# Altium schematic sheet Sheet1.SchDoc
size A4; Author: Samiru Nuwanaka; DrawnBy: Samiru Nuwanaka; Engineer: Samiru Nuwanaka; SheetNumber: 1; SheetTotal: 3
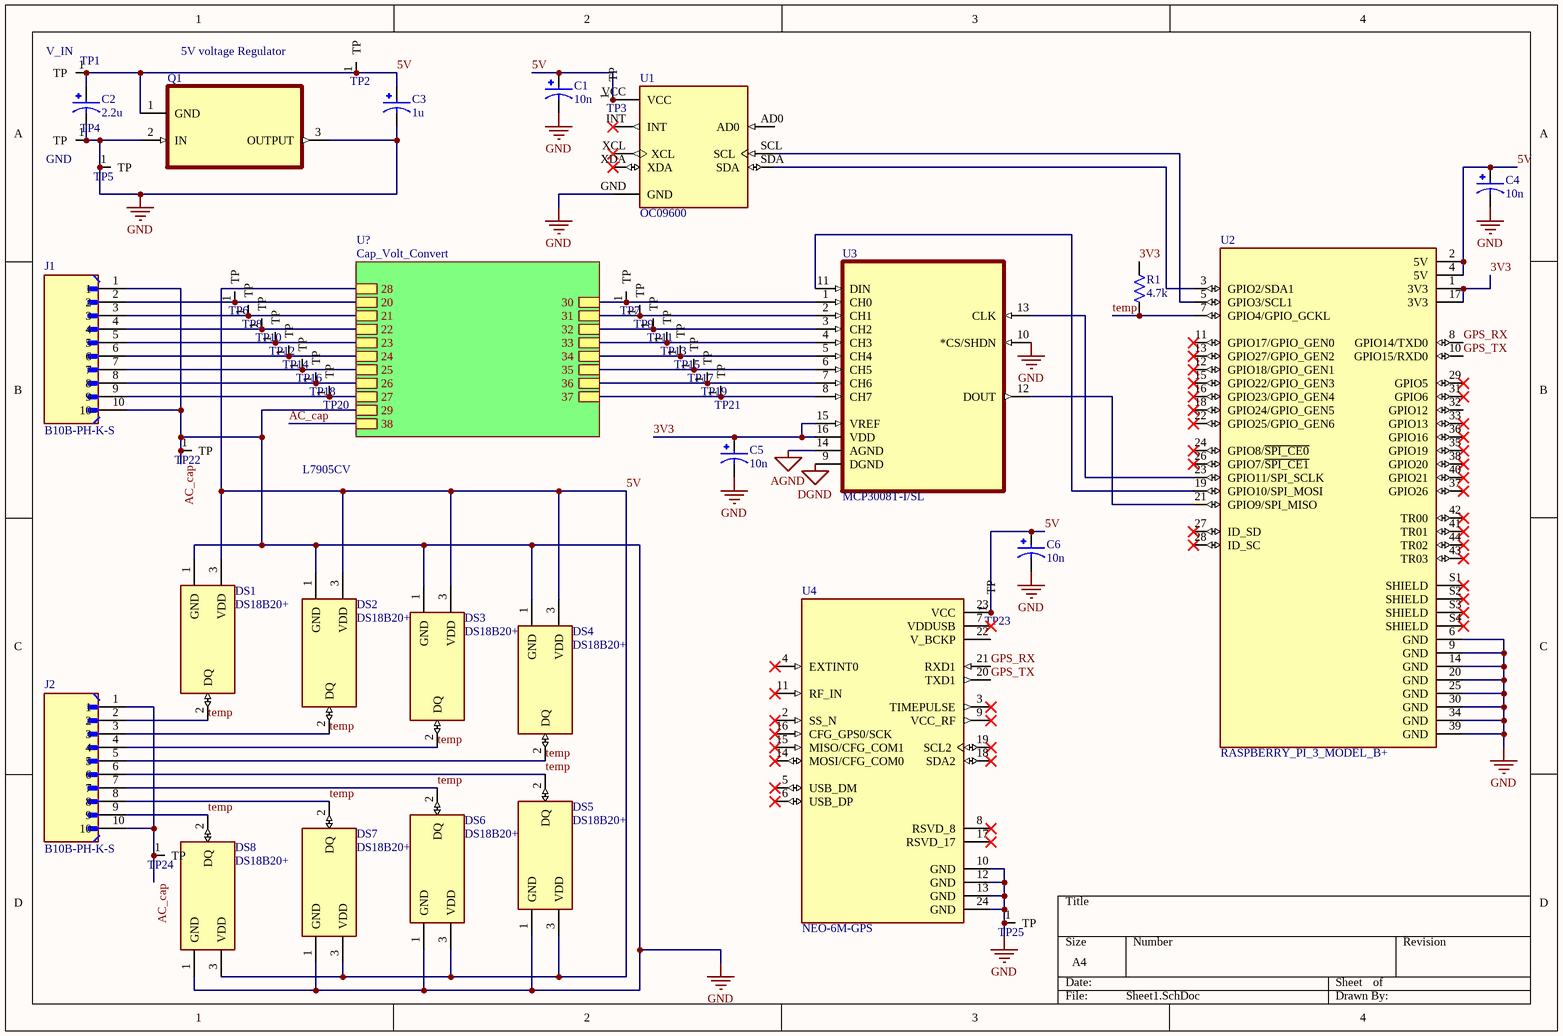
[diagram p0: Sheet1.SchDoc]

## Parts
C1  10n  [CAPPRD750W80D1600H2000]
C2  2.2u  [CAPPRD750W80D1600H2000]
C3  1u  [CAPPRD750W80D1600H2000]
C4  10n  [CAPPRD750W80D1600H2000]
C5  10n  [CAPPRD750W80D1600H2000]
C6  10n  [CAPPRD750W80D1600H2000]
DS1  DS18B20+  [IC_DS18B20+]
DS2  DS18B20+  [IC_DS18B20+]
DS3  DS18B20+  [IC_DS18B20+]
DS4  DS18B20+  [IC_DS18B20+]
DS5  DS18B20+  [IC_DS18B20+]
DS6  DS18B20+  [IC_DS18B20+]
DS7  DS18B20+  [IC_DS18B20+]
DS8  DS18B20+  [IC_DS18B20+]
J1  B10B-PH-K-S  [JST_B10B-PH-K-S]
J2  B10B-PH-K-S  [JST_B10B-PH-K-S]
Q1  L7905CV  [TO254P450X1020X1935-3P]
R1  4.7k  [RESAD730W45L370D210]
TP1  V_IN  [Testpoint]  (net tie, no BOM)
TP2  Testpoint  [Testpoint SMD]  (value not drawn)  (net tie, no BOM)
TP3  Testpoint  [Testpoint SMD]  (value not drawn)  (net tie, no BOM)
TP4  GND  [Testpoint]  (net tie, no BOM)
TP5  Testpoint  [Testpoint SMD]  (value not drawn)  (net tie, no BOM)
TP6  Testpoint  [Testpoint SMD]  (value not drawn)  (net tie, no BOM)
TP7  Testpoint  [Testpoint SMD]  (value not drawn)  (net tie, no BOM)
TP8  Testpoint  [Testpoint SMD]  (value not drawn)  (net tie, no BOM)
TP9  Testpoint  [Testpoint SMD]  (value not drawn)  (net tie, no BOM)
TP10  Testpoint  [Testpoint SMD]  (value not drawn)  (net tie, no BOM)
TP11  Testpoint  [Testpoint SMD]  (value not drawn)  (net tie, no BOM)
TP12  Testpoint  [Testpoint SMD]  (value not drawn)  (net tie, no BOM)
TP13  Testpoint  [Testpoint SMD]  (value not drawn)  (net tie, no BOM)
TP14  Testpoint  [Testpoint SMD]  (value not drawn)  (net tie, no BOM)
TP15  Testpoint  [Testpoint SMD]  (value not drawn)  (net tie, no BOM)
TP16  Testpoint  [Testpoint SMD]  (value not drawn)  (net tie, no BOM)
TP17  Testpoint  [Testpoint SMD]  (value not drawn)  (net tie, no BOM)
TP18  Testpoint  [Testpoint SMD]  (value not drawn)  (net tie, no BOM)
TP19  Testpoint  [Testpoint SMD]  (value not drawn)  (net tie, no BOM)
TP20  Testpoint  [Testpoint SMD]  (value not drawn)  (net tie, no BOM)
TP21  Testpoint  [Testpoint SMD]  (value not drawn)  (net tie, no BOM)
TP22  Testpoint  [Testpoint]  (value not drawn)  (net tie, no BOM)
TP23  Testpoint  [Testpoint SMD]  (value not drawn)  (net tie, no BOM)
TP24  Testpoint  [Testpoint SMD]  (value not drawn)  (net tie, no BOM)
TP25  Testpoint  [Testpoint SMD]  (value not drawn)  (net tie, no BOM)
U1  OC09600  [MODULE_OC09600]
U2  RASPBERRY_PI_3_MODEL_B+  [MODULE_RASPBERRY_PI_3_MODEL_B+]
U3  MCP3008T-I/SL  [SOIC127P600X175-16N]
U4  NEO-6M-GPS  [XCVR_NEO-6M-GPS]

## Sub-sheets
U? = Cap_Volt_Convert: 20, 21, 22, 23, 24, 25, 26, 27, 28, 29, 30, 31, 32, 33, 34, 35, 36, 37, 38

## Nets
AC_cap: C1.N C2.N C3.N C4.N C5.N C6.N DS1.1(GND) DS2.1(GND) DS3.1(GND) DS4.1(GND) DS5.1(GND) DS6.1(GND) DS7.1(GND) DS8.1(GND) J1.1 J1.10 J2.1 J2.10 Q1.2(IN) Q1.3(OUTPUT) TP4.1(TP) TP5.1(TP) TP22.1(TP) TP24.1(TP) TP25.1(TP) U1.GND U2.6(GND) U2.9(GND) U2.14(GND) U2.20(GND) U2.25(GND) U2.30(GND) U2.34(GND) U2.39(GND) U3.10(*CS/SHDN) U4.10(GND) U4.12(GND) U4.13(GND) U4.24(GND) ; sheet U?/29, sheet U?/38  [also labelled GND]
AGND: U3.14(AGND)
DGND: U3.9(DGND)
3V3: C5.P R1.2 U2.1(3V3) U2.17(3V3) U3.15(VREF) U3.16(VDD)
5V: C1.P C2.P C3.P C4.P C6.P DS1.3(VDD) DS2.3(VDD) DS3.3(VDD) DS4.3(VDD) DS5.3(VDD) DS6.3(VDD) DS7.3(VDD) DS8.3(VDD) Q1.1(GND) TP1.1(TP) TP2.1(TP) TP3.1(TP) TP23.1(TP) U1.VCC U2.2(5V) U2.4(5V) U4.23(VCC) ; sheet U?/28
GPS_RX: U2.8(GPIO14/TXD0) U4.21(RXD1)
GPS_TX: U2.10(GPIO15/RXD0) U4.20(TXD1)
temp: DS1.2(DQ) DS2.2(DQ) DS3.2(DQ) DS4.2(DQ) DS5.2(DQ) DS6.2(DQ) DS7.2(DQ) DS8.2(DQ) J2.2 J2.3 J2.4 J2.5 J2.6 J2.7 J2.8 J2.9 R1.1 U2.7(GPIO4/GPIO_GCKL)
NetJ1_2: J1.2 TP6.1(TP) ; sheet U?/20
NetJ1_3: J1.3 TP8.1(TP) ; sheet U?/21
NetJ1_4: J1.4 TP10.1(TP) ; sheet U?/22
NetJ1_5: J1.5 TP12.1(TP) ; sheet U?/23
NetJ1_6: J1.6 TP14.1(TP) ; sheet U?/24
NetJ1_7: J1.7 TP16.1(TP) ; sheet U?/25
NetJ1_8: J1.8 TP18.1(TP) ; sheet U?/26
NetJ1_9: J1.9 TP20.1(TP) ; sheet U?/27
NetTP7_1: TP7.1(TP) U3.1(CH0) ; sheet U?/30
NetTP9_1: TP9.1(TP) U3.2(CH1) ; sheet U?/31
NetTP11_1: TP11.1(TP) U3.3(CH2) ; sheet U?/32
NetTP13_1: TP13.1(TP) U3.4(CH3) ; sheet U?/33
NetTP15_1: TP15.1(TP) U3.5(CH4) ; sheet U?/34
NetTP17_1: TP17.1(TP) U3.6(CH5) ; sheet U?/35
NetTP19_1: TP19.1(TP) U3.7(CH6) ; sheet U?/36
NetTP21_1: TP21.1(TP) U3.8(CH7) ; sheet U?/37
NetU1_SCL: U1.SCL U2.5(GPIO3/SCL1)
NetU1_SDA: U1.SDA U2.3(GPIO2/SDA1)
NetU2_19: U2.19(GPIO10/SPI_MOSI) U3.11(DIN)
NetU2_21: U2.21(GPIO9/SPI_MISO) U3.12(DOUT)
NetU2_23: U2.23(GPIO11/SPI_SCLK) U3.13(CLK)

Not connected (* = marked no-connect by the designer): U1 AD0 INT* XCL* XDA*; U2 11(GPIO17/GPIO_GEN0)* 12(GPIO18/GPIO_GEN1)* 13(GPIO27/GPIO_GEN2)* 15(GPIO22/GPIO_GEN3)* 16(GPIO23/GPIO_GEN4)* 18(GPIO24/GPIO_GEN5)* 22(GPIO25/GPIO_GEN6)* 24(GPIO8/~{SPI_CE0})* 26(GPIO7/~{SPI_CE1})* 27(ID_SD)* 28(ID_SC)* 29(GPIO5)* 31(GPIO6)* 32(GPIO12) 33(GPIO13)* 35(GPIO19)* 36(GPIO16)* 37(GPIO26)* 38(GPIO20)* 40(GPIO21)* 41(TR01)* 42(TR00)* 43(TR03)* 44(TR02)* S1(SHIELD)* S2(SHIELD)* S3(SHIELD)* S4(SHIELD)*; U4 2(SS_N)* 3(TIMEPULSE)* 4(EXTINT0)* 5(USB_DM)* 6(USB_DP)* 7(VDDUSB)* 8(RSVD_8)* 9(VCC_RF)* 11(RF_IN)* 14(MOSI/CFG_COM0)* 15(MISO/CFG_COM1)* 16(CFG_GPS0/SCK)* 17(RSVD_17)* 18(SDA2)* 19(SCL2)* 22(V_BCKP)

## Notes on the sheet
- 5V voltage Regulator

## Library data of the parts
C1-C6 = EEUFS1J681S: CAP ALUM 680UF 20% 63V THRU HOLE; MP: EEU-FS1J681S; MF: Panasonic Electronic Components; Package: RADIAL-2 Panasonic; Availability: In Stock; SnapEDA_Link: https://www.snapeda.com/parts/EEU-FS1J681S/Panasonic/view-part/5562022/?ref=snap; Price: None; Check_prices: https://www.snapeda.com/parts/EEU-FS1J681S/Panasonic/view-part/5562022/?ref=eda; Value: *
DS1-DS8 = DS18B20+: Programmable Resolution 1-Wire Digital Thermometer; MF: Analog Devices; SnapEDA_Link: https://www.snapeda.com/parts/DS18B20+/Analog+Devices/view-part/?ref=snap; Package: TO-226-3 Maxim; Value: *; MP: DS18B20+; Check_prices: https://www.snapeda.com/parts/DS18B20+/Analog+Devices/view-part/?ref=eda
J1 J2 = B10B-PH-K-S: 2.0 mm pitch/Disconnectable Crimp style connectors; MF: JST Sales America Inc.; SnapEDA_Link: https://www.snapeda.com/parts/B10B-PH-K-S/JST/view-part/?ref=snap; Package: None; Value: *; MP: B10B-PH-K-S; Check_prices: https://www.snapeda.com/parts/B10B-PH-K-S/JST/view-part/?ref=eda
Q1 = L7905CV: Linear Voltage Regulator IC Negative Fixed 1 Output 1.5A TO-220; MF: STMicroelectronics; SnapEDA_Link: https://www.snapeda.com/parts/L7905CV/STMicroelectronics/view-part/?ref=snap; Package: TO-220-3 STMicroelectronics; Value: *; MP: L7905CV; Check_prices: https://www.snapeda.com/parts/L7905CV/STMicroelectronics/view-part/?ref=eda
R1 = MFR-12FTE52-12K5: Metal Film Resistors - Through Hole; MF: YAGEO; SnapEDA_Link: https://www.snapeda.com/parts/MFR-12FTE52-12K5/Yageo/view-part/?ref=snap; Package: RADIAL-2 Yageo; Value: *; MP: MFR-12FTE52-12K5; Check_prices: https://www.snapeda.com/parts/MFR-12FTE52-12K5/Yageo/view-part/?ref=eda
TP1 TP4 = Testpoint
U1 = OC09600: GY-521 6 DOF MPU-6050 Module 3 Axis Accelerometer Gyroscope Module for Arduino; MF: YKS; SnapEDA_Link: https://www.snapeda.com/parts/OC09600/YKS/view-part/?ref=snap; Package: None; Value: *; MP: OC09600; Check_prices: https://www.snapeda.com/parts/OC09600/YKS/view-part/?ref=eda
U2 = RASPBERRY_PI_3_MODEL_B+: Case Plastic, ABS Black Hand Held, Split Sides 3.520 L x 2.740 W (89.41mm x 69.60mm) X 0.980 (24.89mm); MF: Raspberry Pi; MP: RASPBERRY PI 3 MODEL B+; Purchase-URL: https://pricing.snapeda.com/search/part/RASPBERRY PI 3 MODEL B+/?ref=eda; Check_prices: https://www.snapeda.com/parts/RASPBERRY%20PI%203%20MODEL%20B+/Raspberry+Pi/view-part/?ref=eda; SnapEDA_Link: https://www.snapeda.com/parts/RASPBERRY%20PI%203%20MODEL%20B+/Raspberry+Pi/view-part/?ref=snap; Price: None; Availability: In Stock; Package: Raspberry Pi; Value: *
U3 = MCP3008T-I/SL: 10-bit ADC, SPI, 8-channel16 SOIC .150in T/R | Microchip Technology Inc. MCP3008T-I/SL; SnapEDA_Link: https://www.snapeda.com/parts/MCP3008T-I/SL/Microchip/view-part/?ref=snap; Package: SOIC-16 Microchip; Value: *; MF: Microchip Technology; MP: MCP3008T-I/SL; Check_prices: https://www.snapeda.com/parts/MCP3008T-I/SL/Microchip/view-part/?ref=eda
U4 = NEO-6M-GPS: GPS Development Tools SparkFun GNSS-RTK Dead Reckoning Breakout - ZED-F9K (Qwiic); MF: u-blox; SnapEDA_Link: https://www.snapeda.com/parts/NEO-6M-GPS/u-blox/view-part/?ref=snap; MP: NEO-6M-GPS; Availability: Not in stock; Price: None; Check_prices: https://www.snapeda.com/parts/NEO-6M-GPS/u-blox/view-part/?ref=eda; Value: *; Package: None